# EAGLE design atmouse (EAGLE 8.4.2)
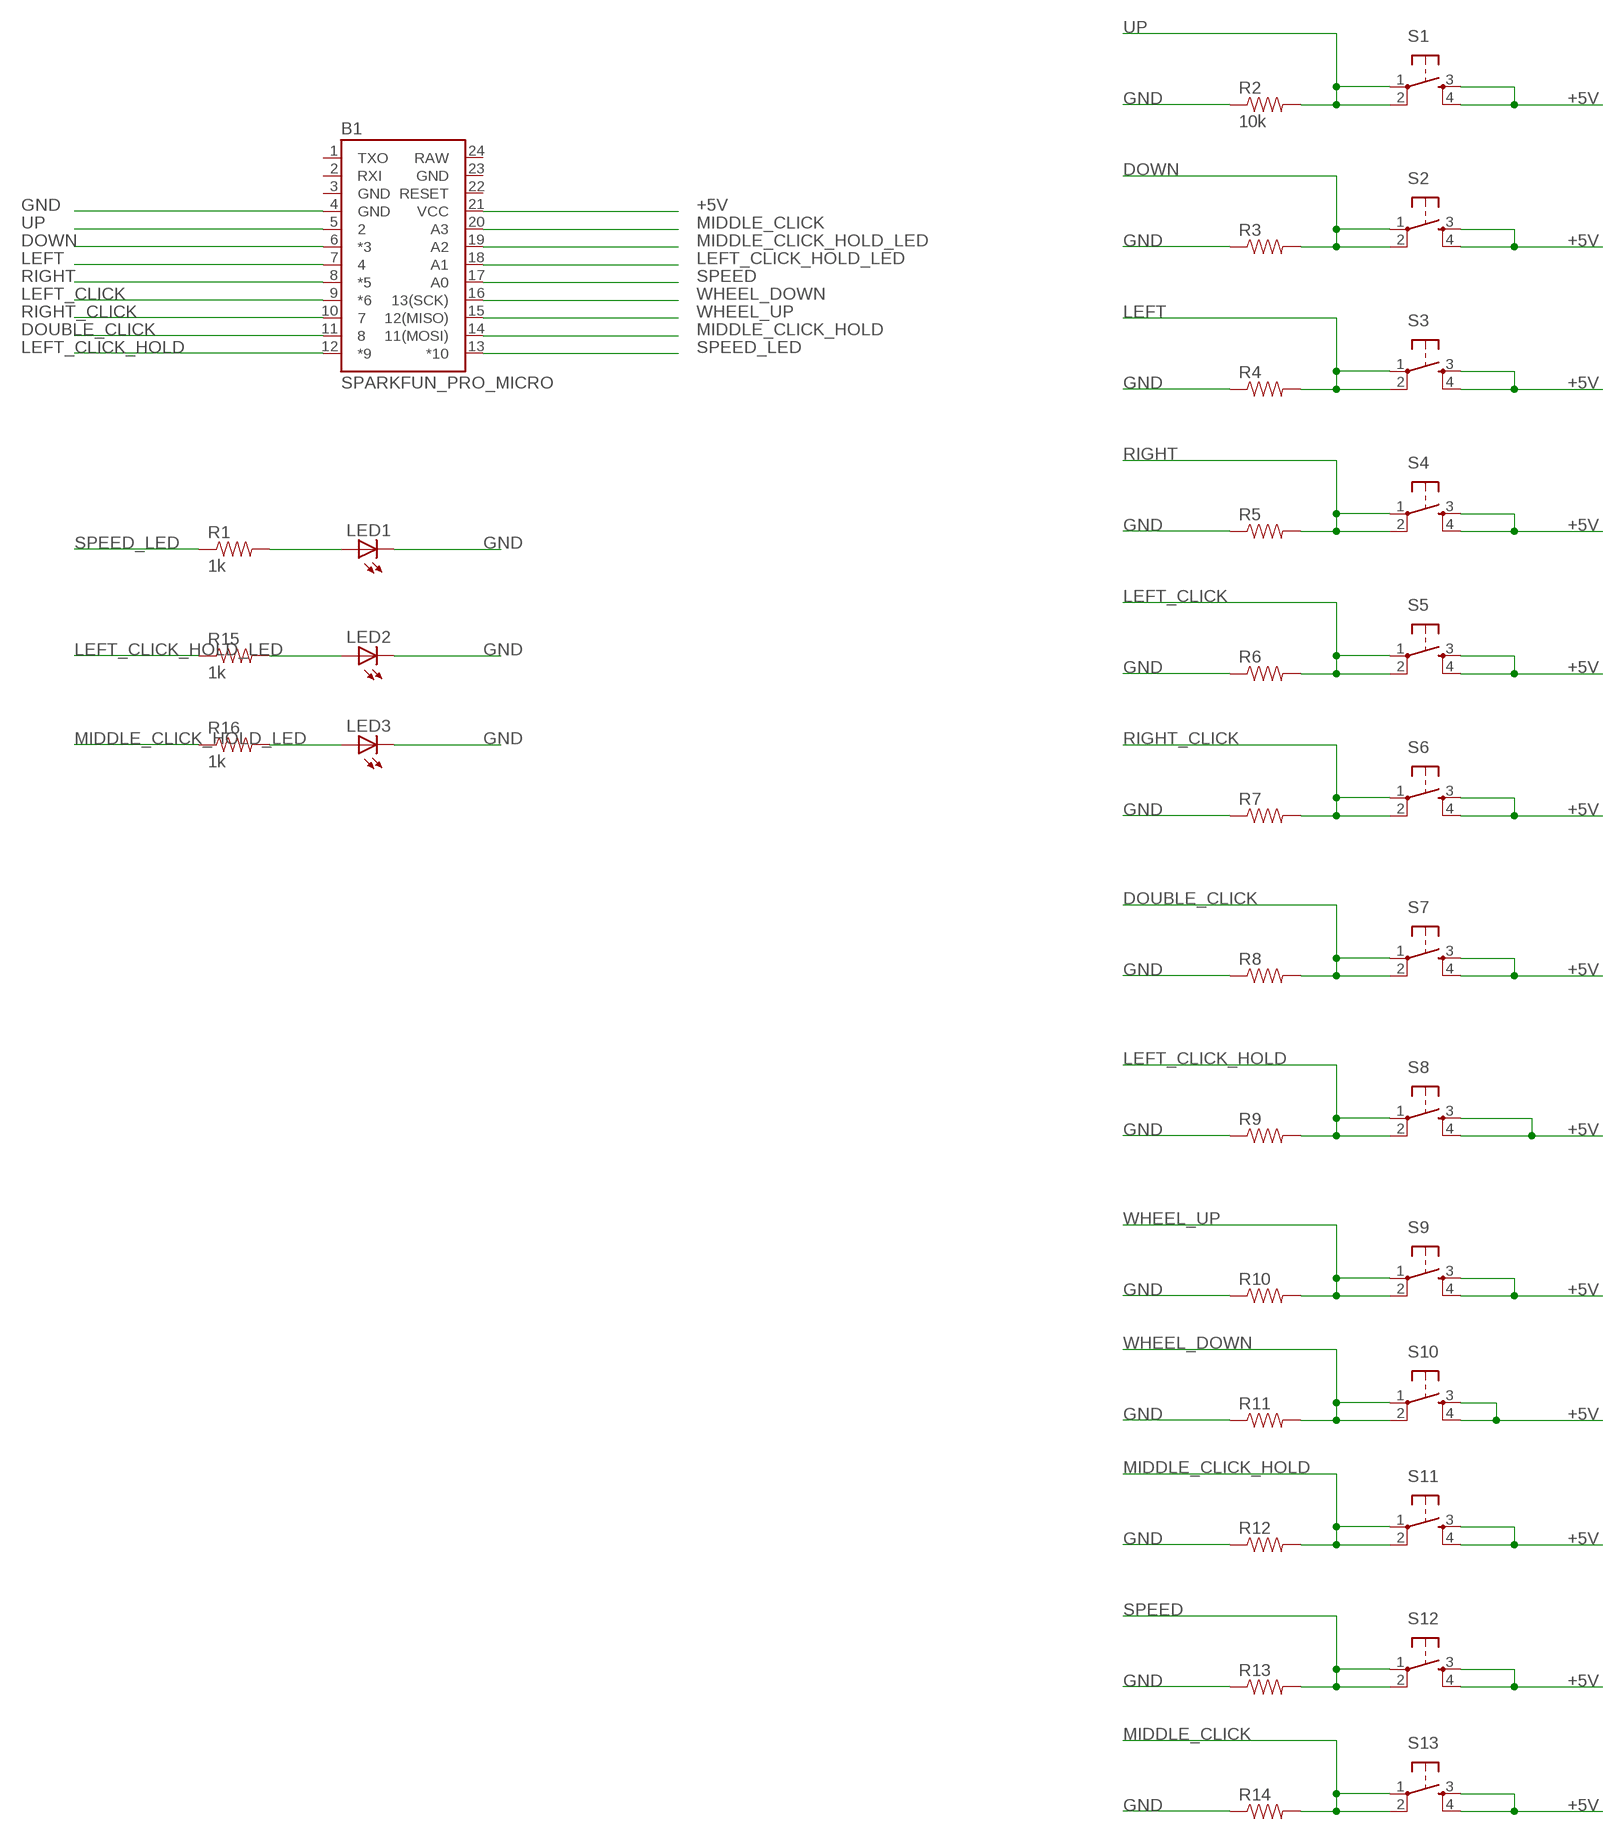
[diagram p0: schematic, sheet 1]

## Parts
B1  SPARKFUN_PRO_MICRO  [SPARKFUN_PRO_MICRO]
LED1  LED5MM  [LED5MM]
LED2  LED5MM  [LED5MM]
LED3  LED5MM  [LED5MM]
R1  1k  RESISTORPTH-1/2W  [AXIAL-0.5]
R2  10k  RESISTORPTH-1/2W  [AXIAL-0.5]
R3  RESISTORPTH-1/2W  [AXIAL-0.5]
R4  RESISTORPTH-1/2W  [AXIAL-0.5]
R5  RESISTORPTH-1/2W  [AXIAL-0.5]
R6  RESISTORPTH-1/2W  [AXIAL-0.5]
R7  RESISTORPTH-1/2W  [AXIAL-0.5]
R8  RESISTORPTH-1/2W  [AXIAL-0.5]
R9  RESISTORPTH-1/2W  [AXIAL-0.5]
R10  RESISTORPTH-1/2W  [AXIAL-0.5]
R11  RESISTORPTH-1/2W  [AXIAL-0.5]
R12  RESISTORPTH-1/2W  [AXIAL-0.5]
R13  RESISTORPTH-1/2W  [AXIAL-0.5]
R14  RESISTORPTH-1/2W  [AXIAL-0.5]
R15  1k  RESISTORPTH-1/2W  [AXIAL-0.5]
R16  1k  RESISTORPTH-1/2W  [AXIAL-0.5]
S1  TAC_SWITCHPTH  [TACTILE-PTH]
S2  TAC_SWITCHPTH  [TACTILE-PTH]
S3  TAC_SWITCHPTH  [TACTILE-PTH]
S4  TAC_SWITCHPTH  [TACTILE-PTH]
S5  TAC_SWITCHPTH  [TACTILE-PTH]
S6  TAC_SWITCHPTH  [TACTILE-PTH]
S7  TAC_SWITCHPTH  [TACTILE-PTH]
S8  TAC_SWITCHPTH  [TACTILE-PTH]
S9  TAC_SWITCHPTH  [TACTILE-PTH]
S10  TAC_SWITCHPTH  [TACTILE-PTH]
S11  TAC_SWITCHPTH  [TACTILE-PTH]
S12  TAC_SWITCHPTH  [TACTILE-PTH]
S13  TAC_SWITCHPTH  [TACTILE-PTH]

## Nets
+5V: B1.21(VCC) S1.3 S1.4 S2.3 S2.4 S3.3 S3.4 S4.3 S4.4 S5.3 S5.4 S6.3 S6.4 S7.3 S7.4 S8.3 S8.4 S9.3 S9.4 S10.3 S10.4 S11.3 S11.4 S12.3 S12.4 S13.3 S13.4
DOUBLE_CLICK: B1.11 R8.P$2 S7.1 S7.2
DOWN: B1.6(*3) R3.P$2 S2.1 S2.2
GND: B1.4(GND) LED1.K(C) LED2.K(C) LED3.K(C) R2.P$1 R3.P$1 R4.P$1 R5.P$1 R6.P$1 R7.P$1 R8.P$1 R9.P$1 R10.P$1 R11.P$1 R12.P$1 R13.P$1 R14.P$1
LEFT: B1.7 R4.P$2 S3.1 S3.2
LEFT_CLICK: B1.9(*6) R6.P$2 S5.1 S5.2
LEFT_CLICK_HOLD: B1.12(*9) R9.P$2 S8.1 S8.2
LEFT_CLICK_HOLD_LED: B1.18(A1) R15.P$1
MIDDLE_CLICK: B1.20(A3) R14.P$2 S13.1 S13.2
MIDDLE_CLICK_HOLD: B1.14(11(MOSI)) R12.P$2 S11.1 S11.2
MIDDLE_CLICK_HOLD_LED: B1.19(A2) R16.P$1
N$1: LED1.A R1.P$2
N$5: LED2.A R15.P$2
N$6: LED3.A R16.P$2
RIGHT: B1.8(*5) R5.P$2 S4.1 S4.2
RIGHT_CLICK: B1.10 R7.P$2 S6.1 S6.2
SPEED: B1.17(A0) R13.P$2 S12.1 S12.2
SPEED_LED: B1.13(*10) R1.P$1
UP: B1.5 R2.P$2 S1.1 S1.2
WHEEL_DOWN: B1.16(13(SCK)) R11.P$2 S10.1 S10.2
WHEEL_UP: B1.15(12(MISO)) R10.P$2 S9.1 S9.2
Unconnected: B1.1(TXO) B1.2(RXI) B1.22(RESET)

## Power pins joined to a net without a drawn wire
GND: B1.3(GND) B1.23(GND)
RAW: B1.24(RAW)

## Library data of the parts
B1 = SparkFun-Boards:SPARKFUN_PRO_MICRO: SparkFun Pro Micro Atmega32U4 compatible footprint. SparkFun Products: 3.3V/8MHz <https://www.sparkfun.com/products/12587> 5V/16MHz <https://www.sparkfun.com/products/12640>
LED1-LED3 = adafruit:LED: LED OSRAM: - CHIPLED LG R971, LG N971, LY N971, LG Q971, LY Q971, LO R971, LY R971 LH N974, LH R974 LS Q976, LO Q976, LY Q976 LO Q996 - Hyper CHIPLED LW Q18S LB Q993, LB Q99A, LB R99A - SideLED LS A670, LO A670, LY A670, LG A670, LP A670 LB A673, LV A673, LT A673, LW A673 LH A674 LY A675 LS A676, LA A676, LO A676, LY A676, LW A676 LS A679, LY A679, LG A679 - Hyper Micro SIDELED® LS Y876, LA Y876, LO Y876, LY Y876 LT Y87S - SmartLED LW L88C, LW L88S LB L89C, LB L89S, LG L890 LS L89K, LO L89K, LY L89K LS L896, LA L896, LO L896, LY L896 - TOPLED LS T670, LO T670, LY T670, LG T670, LP T670 LSG T670, LSP T670, LSY T670, LOP T670, LYG T670 LG T671, LOG T671, LSG T671 LB T673, LV T673, LT T673, LW T673 LH T674 LS T676, LA T676, LO T676, LY T676, LB T676, LH T676, LSB T676, LW T676 LB T67C, LV T67C, LT T67C, LS T67K, LO T67K, LY T67K, LW E67C LS E67B, LA E67B, LO E67B, LY E67B, LB E67C, LV E67C, LT E67C LW T67C LS T679, LY T679, LG T679 LS T770, LO T770, LY T770, LG T770, LP T770 LB T773, LV T773, LT T773, LW T773 LH T774 LS E675, LA E675, LY E675, LS T675 LS T776, LA T776, LO T776, LY T776, LB T776 LHGB T686 LT T68C, LB T68C - Hyper Mini TOPLED® LB M676 - Mini TOPLED Santana® LG M470 LS M47K, LO M47K, LY M47K Source: http://www.osram.convergy.de/
R1-R16 = SparkFun-Resistors:RESISTOR: Resistor Basic schematic elements and footprints for 0603, 1206, and PTH resistors.
S1-S13 = appfruits:TAC_SWITCH: Momentary Switch Button commonly used for reset or general input. Spark Fun Electronics SKU : COM-00097 SMT- SWCH-08247

## Board
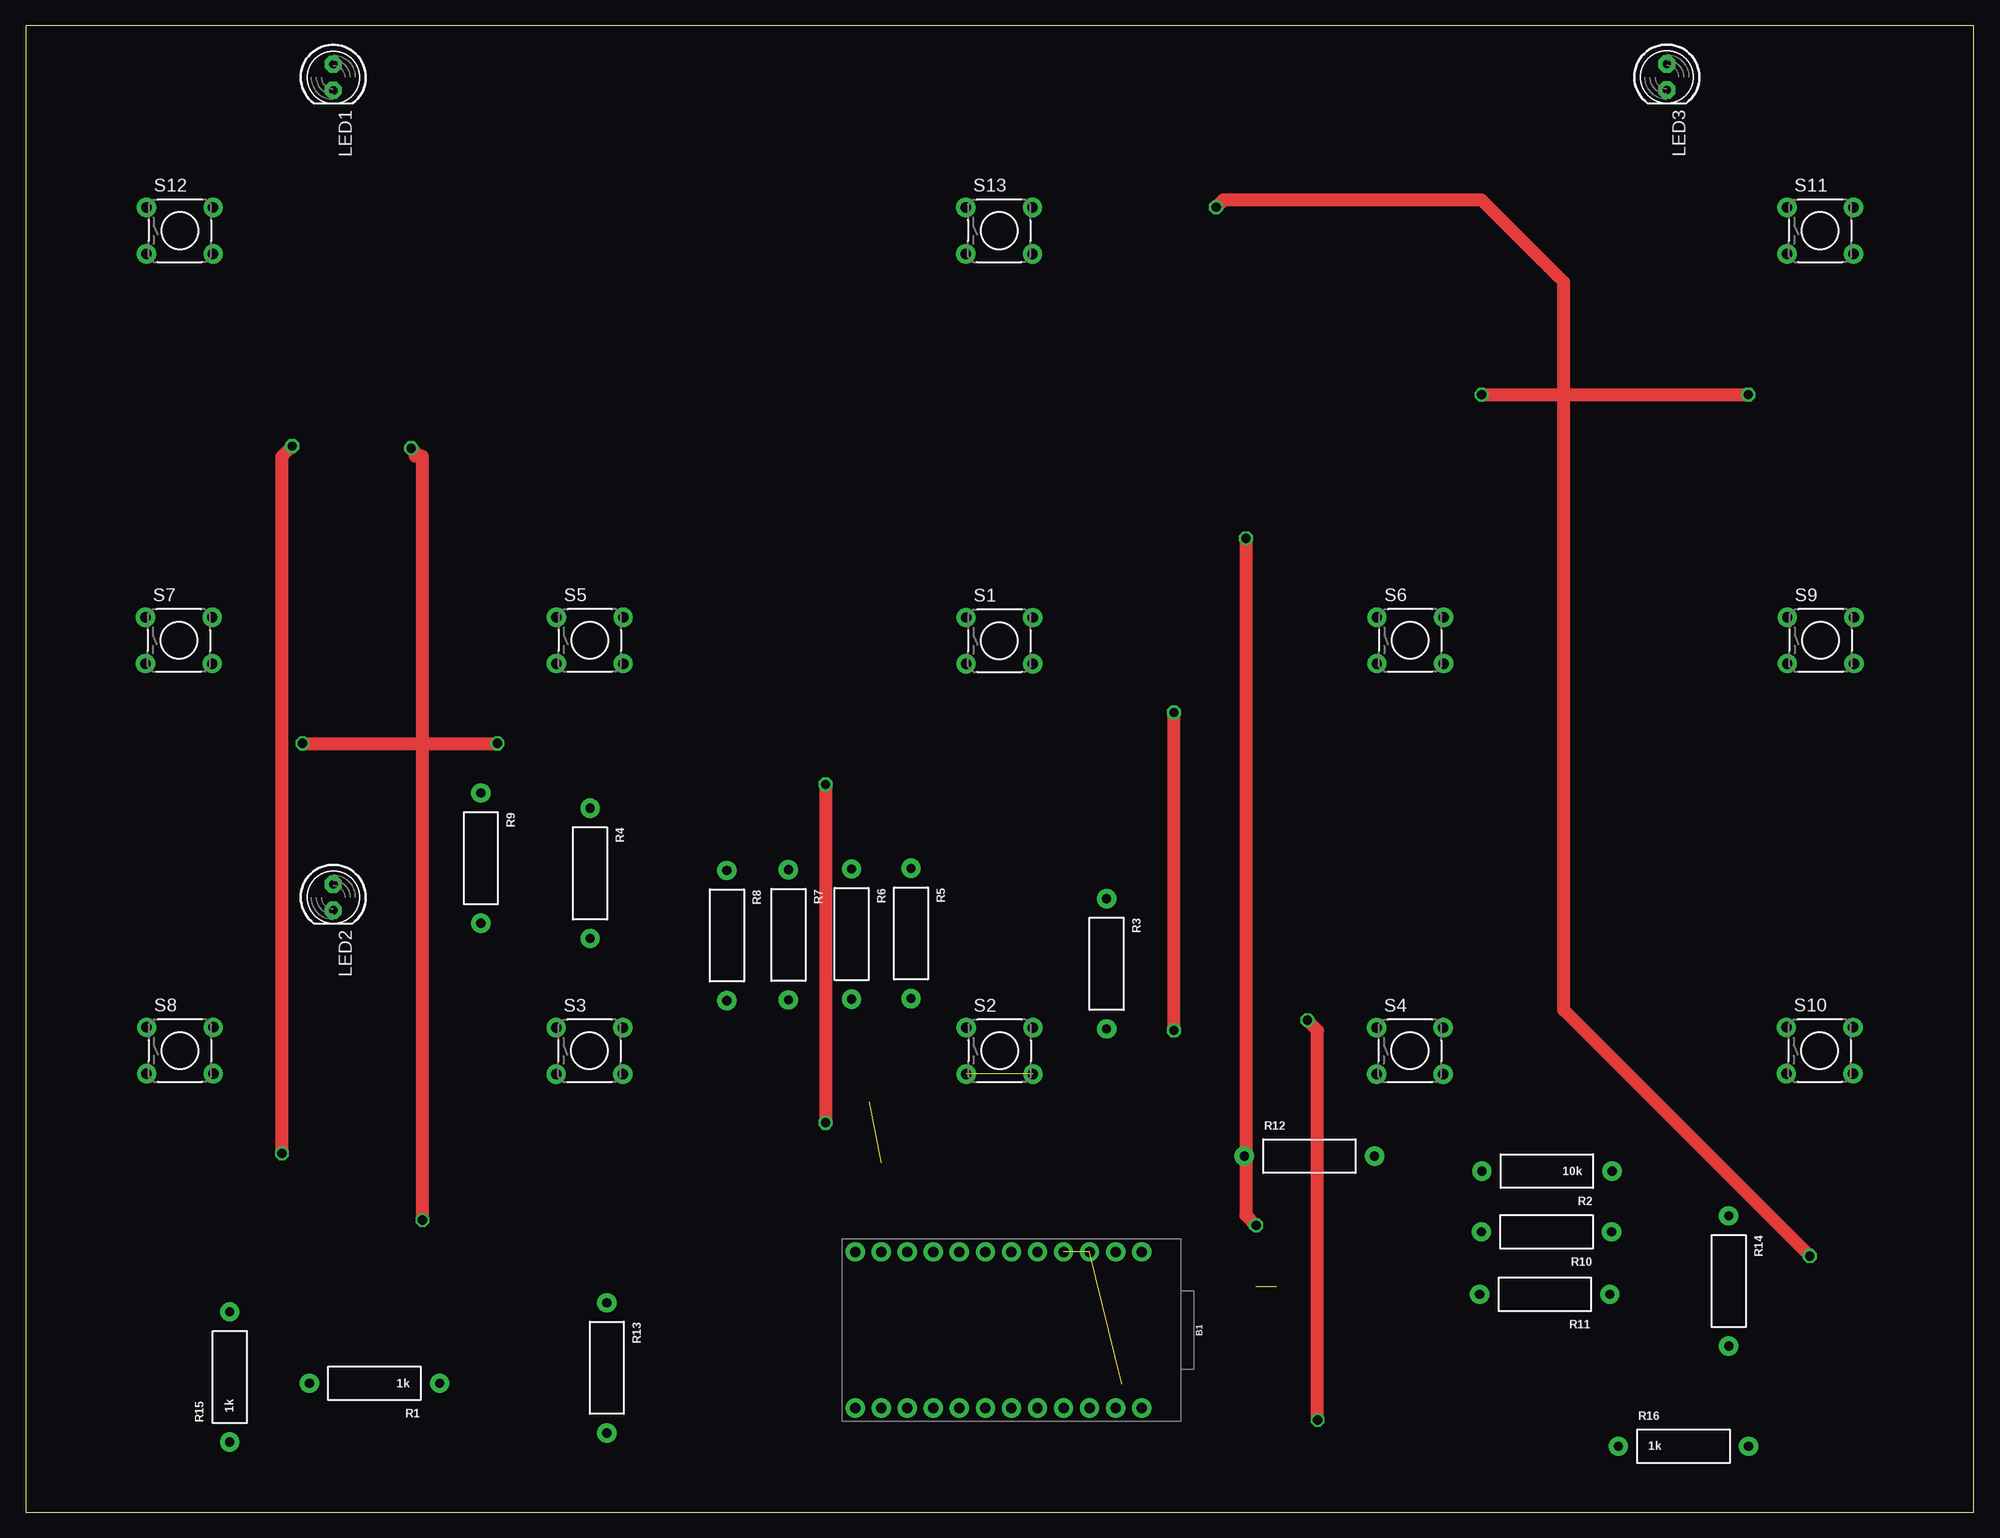
[diagram p1: board, top side]
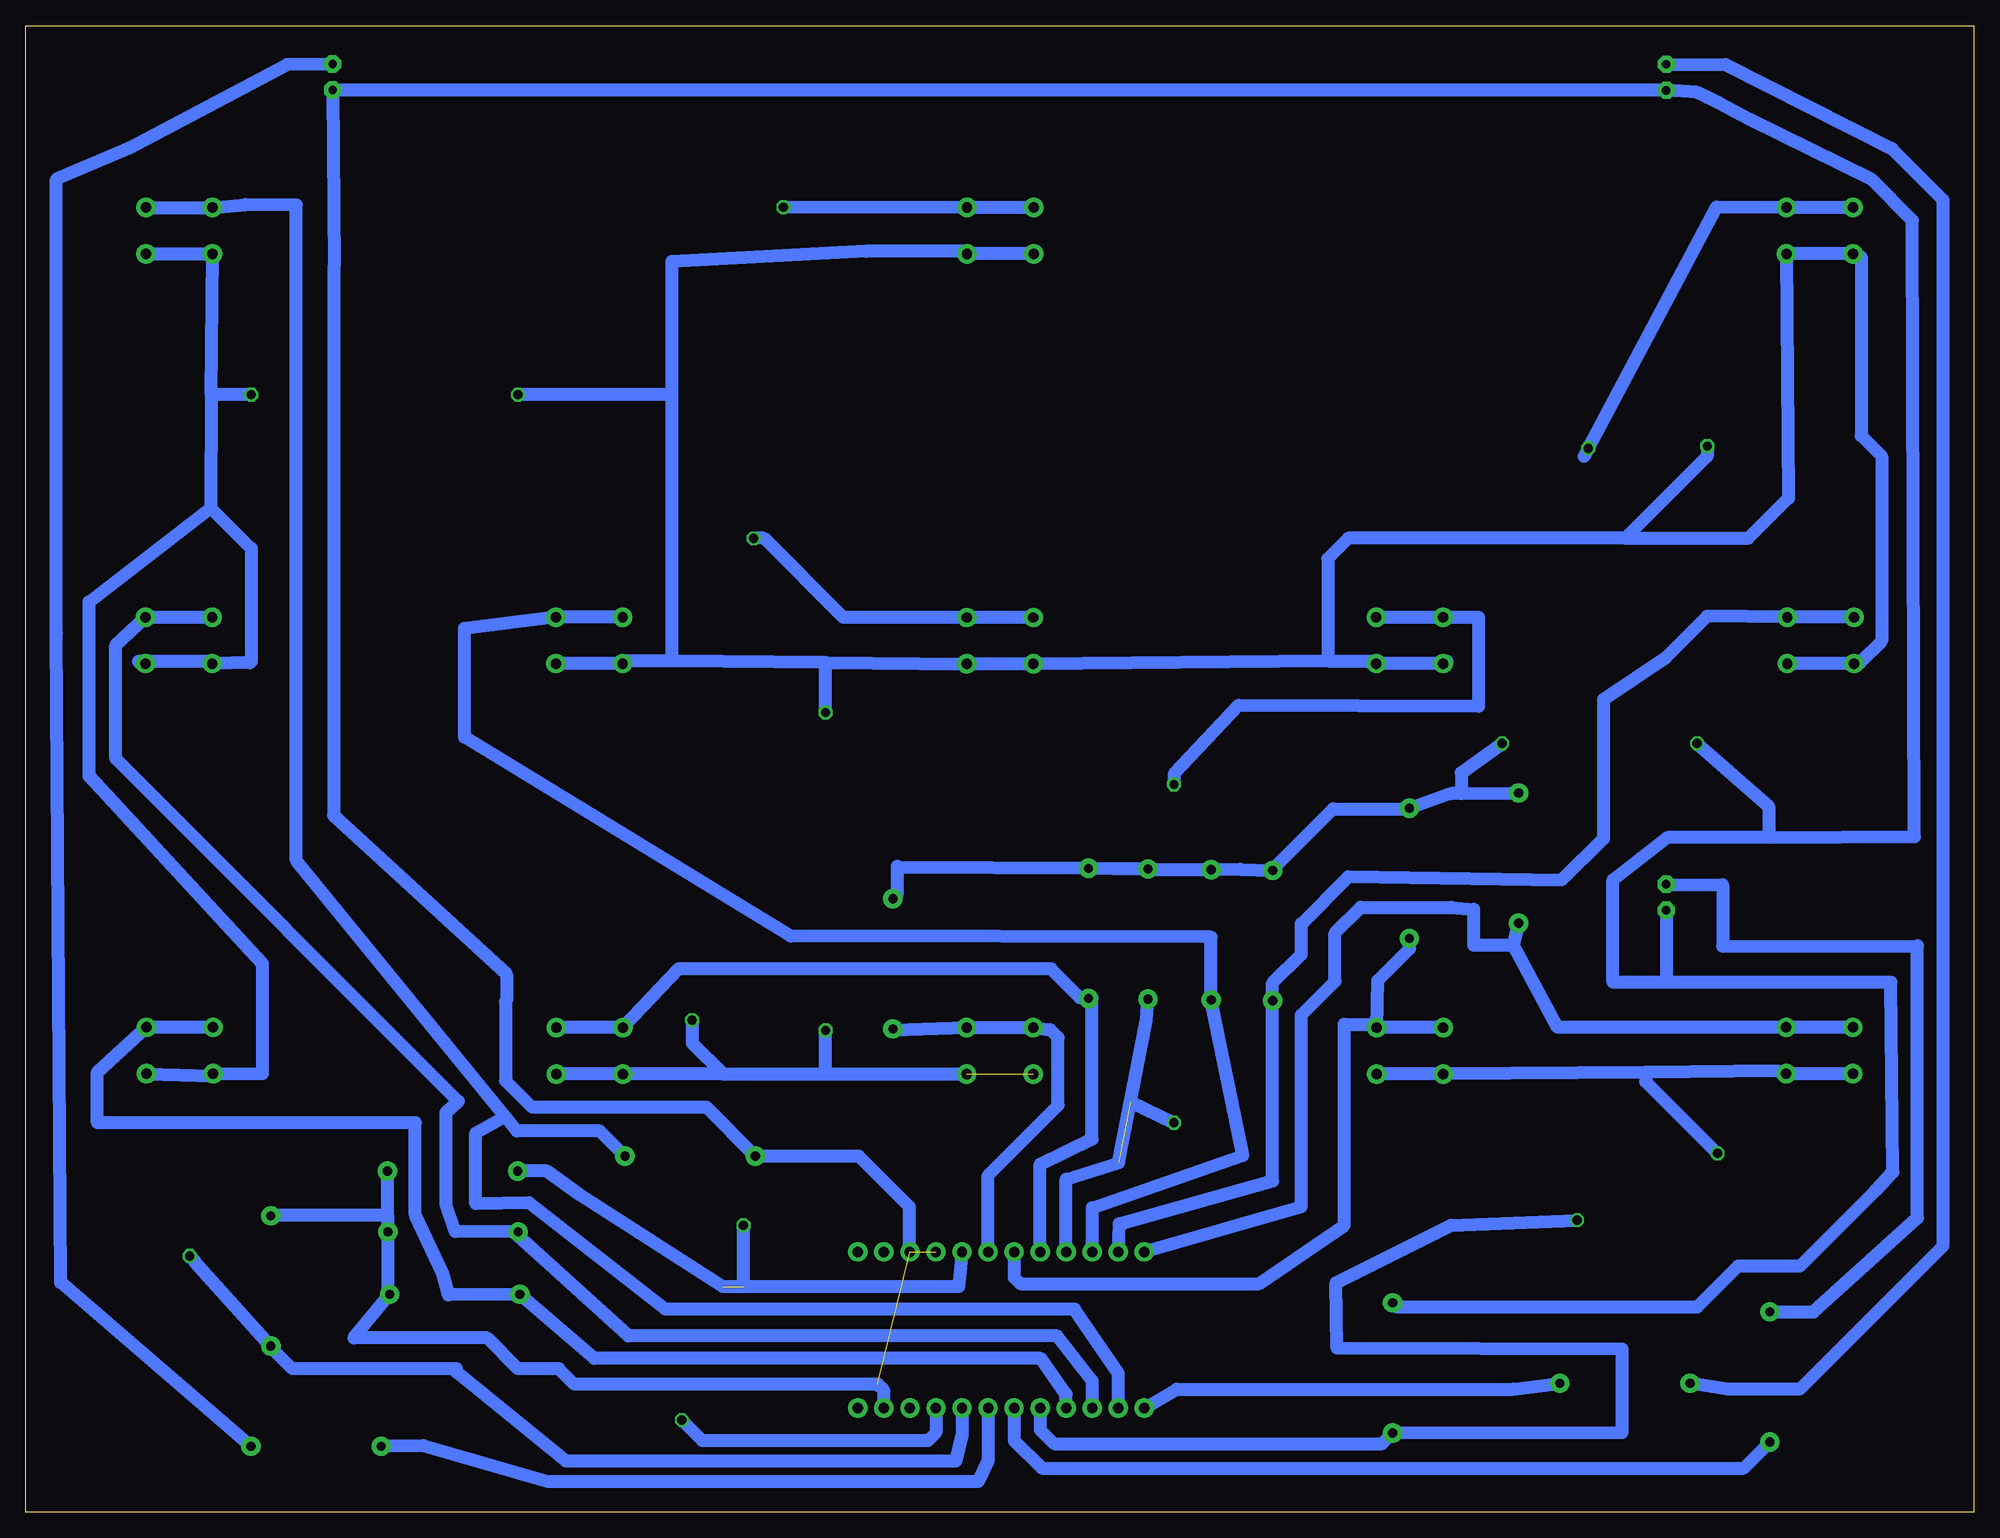
[diagram p2: board, bottom side, seen from below]

Size 190 x 145 mm. Coordinates in mm from the lower left corner, seen from the top.
Outline: 0,0 190,0 190,145 0,145 0,0
Copper layers (1*16): Top 0.035mm / dielectric 1.5mm / Bottom 0.035mm
Design rules "default": minimum track width 6mil, minimum drill 0.35mm, track to track 6mil, track to pad 6mil, pad to pad 6mil, via to via 6mil, smd to smd 6mil, copper to edge 40mil, drill to drill 6mil, minimum pad ring 10mil, minimum via ring 8mil, stop-mask expansion 4mil, vias tented up to drill 0mil, thermal gap 10mil

### Footprints (pad centres in the part's own frame; a part is rotated, then mirrored left to right if it is on the bottom)
SPARKFUN_PRO_MICRO = drill 1.016 pad 1.88: 1 -7.62,12.7; 2 -7.62,10.16; 3 -7.62,7.62; 4 -7.62,5.08; 5 -7.62,2.54; 6 -7.62,0; 7 -7.62,-2.54; 8 -7.62,-5.08; 9 -7.62,-7.62; 10 -7.62,-10.16; 11 -7.62,-12.7; 12 -7.62,-15.24; 13 7.62,-15.24; 14 7.62,-12.7; 15 7.62,-10.16; 16 7.62,-7.62; 17 7.62,-5.08; 18 7.62,-2.54; 19 7.62,0; 20 7.62,2.54; 21 7.62,5.08; 22 7.62,7.62; 23 7.62,10.16; 24 7.62,12.7
LED5MM = drill 0.813 pad 1.676 octagon: A -1.27,0; K 1.27,0
AXIAL-0.5 = drill 0.9 pad 1.88: P$1 -6.35,0; P$2 6.35,0
TACTILE-PTH = drill 1.016 pad 1.88: 1 -3.251,2.261; 2 3.251,2.261; 3 -3.251,-2.261; 4 3.251,-2.261

### Placement (x,y rotation side)
B1  96.14,17.78 270 top
LED1  30,139.96 270 top
LED2  30,59.99 270 top
LED3  160.06,139.99 270 top
R1  34.02,12.58 180 top
R2  148.36,33.28 180 top
R3  105.42,53.5 270 top
R4  55.04,62.32 270 top
R5  86.34,56.46 270 top
R6  80.54,56.4 270 top
R7  74.39,56.32 270 top
R8  68.39,56.26 270 top
R9  44.39,63.8 270 top
R10  148.32,27.36 180 top
R11  148.16,21.26 180 top
R12  125.2,34.74 0 top
R13  56.68,14.09 270 top
R14  166.09,22.56 270 top
R15  19.91,13.2 90 top
R16  161.68,6.44 0 top
S1  94.97,85.01 0 top
S2  94.98,45.01 0 top
S3  54.99,45.01 0 top
S4  135,45.01 0 top
S5  55.02,85.04 0 top
S6  135.03,85.04 0 top
S7  14.94,85.04 0 top
S8  15.05,45.04 0 top
S9  175.06,85.04 0 top
S10  174.97,45.04 0 top
S11  175.02,125 0 top
S12  15.03,125 0 top
S13  94.94,125 0 top

### Tracks (layer width: path | path; a pad name or v marks a point on that pad's centre or on a via)
+5V  (via drill 0.9 pad 1.3)  (1 unrouted)
  Top 1.27: v126,9 126,47 v125,48 | v112,47 v112,78 | v142,109 v168,109 | v25,35 25,103 v26,104
  Bottom 1.27: S8.3 S8.4 19.13,43.05 32,42.93 | 32,42.93 S3.3 S3.4 | 122,42.75 112,42.75 | 112,42.75 S2.4 | 122,42.75 S4.3 S4.4 | S11.4 S11.3 171.88,109 | 171.88,109 171.97,97.97 | 171.97,97.97 168,94 168,83 168.12,82.88 S9.3 172.03,83 179,83 178.88,82.88 S9.4 | S7.4 S7.3 11.12,82.88 9,85 9,103 11,105 11,122.46 S12.3 S12.4 18.08,98.92 22,95 34,95 | S5.4 S5.3 51.35,83 | S5.4 58.88,82.88 59,83 58.09,83 S5.4 | S5.4 58.14,83.05 63,83.05 | 63,83.05 S1.3 S1.4 111.99,82.89 | 111.99,82.89 127,83.05 | 127,83.05 131.41,83.05 S6.3 S6.4 | S13.3 S13.4 98.23,123 108,123 127,122 127,109 | 127,109 127,83.05 | 63,83.05 63,93 61,95 34,95 | B1.21 101.22,7.78 102,7 124,7 v126,9 | S10.4 171.69,42.55 S10.3 166.9,42.8 166.9,53.5 183.8,71.8 183.8,88.8 171.97,97.97 | v125,48 125,45.75 122,42.75 | 112,42.75 v112,47 | v112,78 112,82.88 111.99,82.89 | 127,109 v142,109 | v168,109 171.88,109 | 32,42.93 32,42 v25,35 | v26,104 26,103 34,95
DOUBLE_CLICK
  Bottom 1.27: B1.11 83.34,28.16 68.39,32.31 R8.P$2 68.39,51.61 65.6,54.4 65.6,57.4 61,62 40.2,61.7 36.1,65.7 36.1,79.3 30,83.4 26,87.4 S7.2 S7.1
DOWN
  Bottom 1.27: B1.6 96.14,32.86 89.3,39.7 89.3,46.3 90.07,47.07 S2.1 S2.2 105.34,47.07 R3.P$2
GND  (via drill 0.9 pad 1.3)  (2 unrouted)
  Top 1.27: v27,75 v46,75
  Bottom 1.27: R3.P$1 105,60.27 105,63 104.91,62.91 R5.P$1 83.9,62.75 R6.P$1 80.56,62.67 R7.P$1 71.55,62.71 R8.P$1 68.19,62.91 62.5,68.6 55.11,68.6 R4.P$1 51,70.1 50,70.11 | R13.P$1 56.24,20 27,20 23,24 17,24 9.58,31.42 7.9,33.2 8.1,51.7 30,51.7 | 154.71,29 154.71,27.4 R10.P$1 154.67,21.42 R11.P$1 158,17 145,17 142,14 138,14 136.5,12.5 106.9,12.5 106.3,11.9 B1.23 | 154.71,29 R2.P$1 | B1.3 103.8,25.44 103.8,29.8 108.74,34.74 R12.P$1 123.61,39.5 140.6,39.5 143.2,42.1 143.2,49.8 143.1,49.9 143.1,52.5 160,68 159.9,68.1 159.9,121.6 LED3.K LED1.K 27,138.5 26,138 24.9,137.5 21.8,135.8 10,130 6,126 5.8,65.9 20,65.84 | R14.P$1 166,29 154.71,29 | 50,70.11 R9.P$1 | LED2.K 30,51.7 | 30,51.7 35.2,51.7 35.2,61.7 29.9,65.8 20,65.84 | v27,75 20,68.86 20,65.84 | v46,75 50,72.11 50,70.11 | 20,65.84 | 50,70.11
LEFT
  Bottom 1.27: B1.7 93.6,22.9 93,22.3 69.7,22.3 61.4,28 61.4,47.6 58.17,47.6 S3.2 | S3.1 S3.2 | S3.2 58.14,51.86 55.04,54.96 R4.P$2
LEFT_CLICK  (via drill 0.9 pad 1.3)  (1 unrouted)
  Top 1.27: v78,71 v78,38
  Bottom 1.27: B1.9 88.52,32.48 83.4,34.1 80.7,48.01 R6.P$2 | S5.2 S5.1 48.3,87.3 48.3,78.6 71.7,78.7 78,72 v78,71 | 82.25,40.05 v78,38
LEFT_CLICK_HOLD
  Bottom 1.27: S8.1 S8.2 32,47.3 | 32,47.3 32.64,47.3 | B1.12 65.6,29.8 65.6,48.5 62.3,51.8 62.3,56.5 59.8,59 51,59 48.8,58.8 48.8,55.3 44.9,55.3 | 44.9,55.3 R9.P$2 | 32,47.3 40.6,47.3 44.9,55.3
LEFT_CLICK_HOLD_LED
  Bottom 1.27: B1.18 93.6,7 90.9,4.3 22.46,4.3 R15.P$1
MIDDLE_CLICK  (via drill 0.9 pad 1.3)
  Top 1.27: v174,25 150,49 150,120 142,128 116.8,128 v116.1,127.3
  Bottom 1.27: B1.20 98.68,7.62 99.3,5 137.3,5 148,13.7 148,14 164,14 166.09,16.09 R14.P$2 173.55,24.5 173.55,24.55 v174,25 | S13.1 S13.2 v116.1,127.3
MIDDLE_CLICK_HOLD
  Bottom 1.27: B1.14 83.44,13.54 87.7,19.8 127.6,19.8 140.9,30.2 146.1,30.1 146.1,37 143.25,38.61 | R12.P$2 134.01,37.2 142.1,37.2 143.25,38.61 | 143.25,38.61 163.6,63.6 163.6,127.5 168.56,127.56 S11.1 S11.2
MIDDLE_CLICK_HOLD_LED
  Bottom 1.27: B1.19 96.14,5.04 97.1,3 139,3 151.19,6.5 R16.P$1
N$1
  Bottom 1.27: R1.P$2 24,12 17,12 3,26 3,128 8,133 24.2,141.2 LED1.A
N$5
  Bottom 1.27: R15.P$2 15.65,19.55 5.5,28.7 5.5,55.26 24.5,55.2 24.5,61.2 LED2.A
N$6
  Bottom 1.27: R16.P$2 186.6,22.41 187,85.8 187,130 180,133 164.5,141.2 LED3.A
RIGHT
  Bottom 1.27: B1.8 91.06,33.94 86,36.4 86,50.17 R5.P$2 87.21,50.21 90,53 126.32,53 S4.1 S4.2
RIGHT_CLICK
  Bottom 1.27: B1.10 85.98,29.72 71.29,34.81 R7.P$2 74.4,56.1 115.4,56.2 147.2,75.6 147.2,86.2 S6.2 S6.1
SPEED  (via drill 0.9 pad 1.3)
  Top 1.27: v38.7,28.5 38.7,103 38,103 38,103.37 v37.59,103.78
  Bottom 1.27: S12.1 S12.2 25.1,127.3 v37.59,103.78 38,103 | B1.17 91.06,8.06 89.7,6.7 57.72,6.7 R13.P$2 34.3,7.8 34.3,15.9 62.1,16 62.2,22.4 51,28 v38.7,28.5
SPEED_LED
  Bottom 1.27: B1.13 77.74,12 44.95,12 R1.P$1
UP  (via drill 0.9 pad 1.3)  (1 unrouted)
  Top 1.27: v119,95 119,29 v120,28
  Bottom 1.27: B1.5 99,22 122,22 136,31 139.2,33.3 R2.P$2 | 120,22 v120,28 | S1.1 S1.2 110.27,87.27 118,95 v119,95
WHEEL_DOWN
  Bottom 1.27: B1.16 88.52,11.52 91,15 134.55,15 R11.P$2 148.75,21.2 149.3,23.2 152,29 152,38 183,38 183,42.92 S10.2 S10.1
WHEEL_UP
  Bottom 1.27: B1.15 85.98,12.78 89.4,17.2 131.2,17.2 141.97,26.97 R10.P$2 148.1,27.4 149,30 149,39 147.8,40.1 181.2,73.5 181.2,84.61 S9.2 S9.1